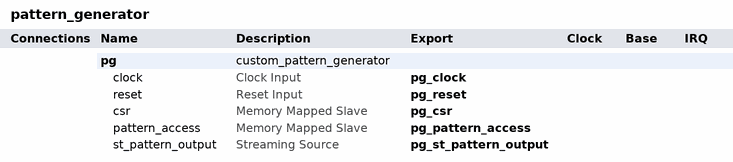
[diagram p0: system contents]
# Platform Designer (Qsys) system pattern_generator
# Parameters at their usual value, and those the tool derives, are not listed.
package require qsys
create_system pattern_generator
set_project_property DEVICE_FAMILY CYCLONEIII

add_instance pg custom_pattern_generator 1.1
set_instance_parameter_value pg DATA_WIDTH 32
set_instance_parameter_value pg MAX_PATTERN_LENGTH 256

# exported interfaces
add_interface pg_reset reset sink
set_interface_property pg_reset EXPORT_OF pg.reset
add_interface pg_csr avalon slave
set_interface_property pg_csr EXPORT_OF pg.csr
add_interface pg_pattern_access avalon slave
set_interface_property pg_pattern_access EXPORT_OF pg.pattern_access
add_interface pg_st_pattern_output avalon_streaming source
set_interface_property pg_st_pattern_output EXPORT_OF pg.st_pattern_output
add_interface pg_clock clock sink
set_interface_property pg_clock EXPORT_OF pg.clock

save_system pattern_generator.qsys
